# Altium project Hub.PrjPCB
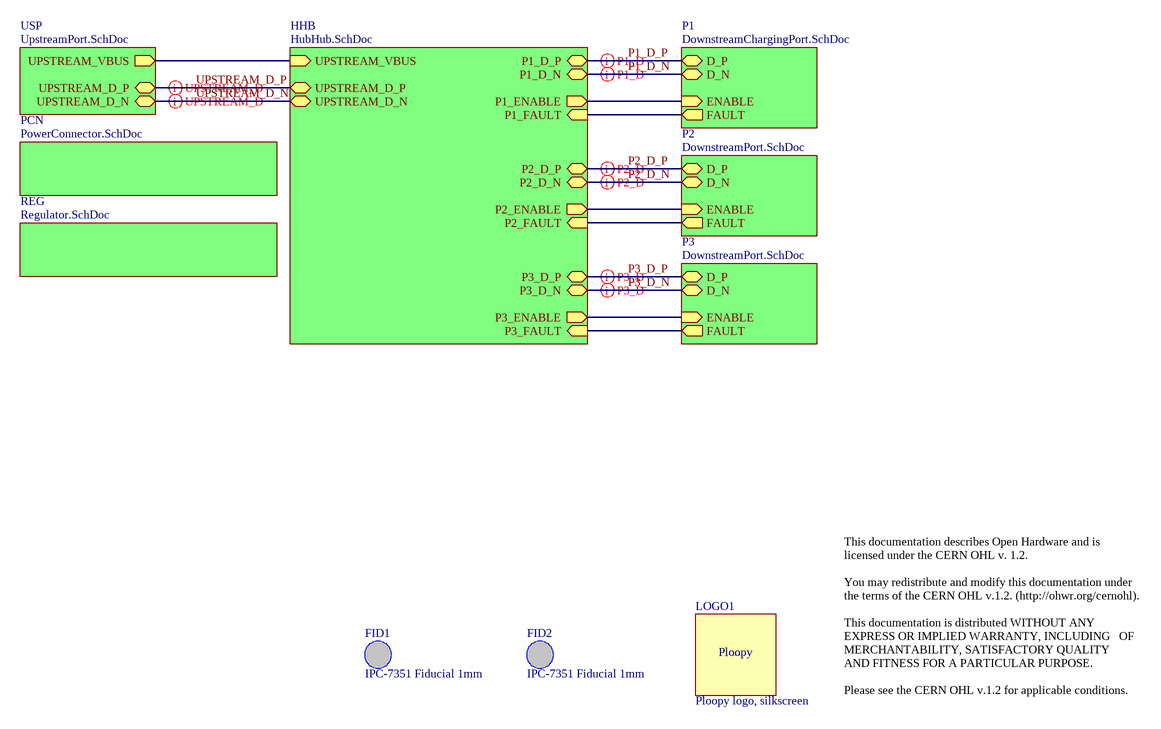
[diagram p0: Hub.SchDoc]
7 sheets, 80 parts. Net scope: hierarchical (ports join the sheet entries above them; power ports are global).
Board file: Hub.PcbDoc
Sheets:
  Hub.SchDoc
    P2 = DownstreamPort.SchDoc
    USP = UpstreamPort.SchDoc
    PCN = PowerConnector.SchDoc
    P1 = DownstreamChargingPort.SchDoc
    REG = Regulator.SchDoc
    HHB = HubHub.SchDoc
    P3 = DownstreamPort.SchDoc

## Sheet Hub.SchDoc
size Letter; CompanyName: Ploopy Co; Organization: Ploopy Co; Address1: 137-1140 Burnhamthorpe Road W; Address2: Mississauga; Address3: Ontario; Address4: Canada L5C 0A3; DocumentNumber: 1; Revision: R1.001; SheetNumber: 1; SheetTotal: 7

### Parts
FID1  IPC-7351 Fiducial 1mm  [FIDUCIAL_1.5]
FID2  IPC-7351 Fiducial 1mm  [FIDUCIAL_1.5]
LOGO1  Ploopy logo, silkscreen  [PloopyLogo]  (no BOM)

### Sub-sheets
HHB = HubHub.SchDoc: P1_ENABLE (out), P2_FAULT (in), P3_FAULT (in), P1_FAULT (in), UPSTREAM_VBUS (in), P3_ENABLE (out), P2_ENABLE (out), P3_D_P (bidir), UPSTREAM_D_P (bidir), P1_D_N (bidir), UPSTREAM_D_N (bidir), P2_D_P (bidir), P2_D_N (bidir), P1_D_P (bidir), P3_D_N (bidir)
P1 = DownstreamChargingPort.SchDoc: FAULT (out), ENABLE (in), D_N (bidir), D_P (bidir)
P2 = DownstreamPort.SchDoc: ENABLE (in), FAULT (out), D_N (bidir), D_P (bidir)
P3 = DownstreamPort.SchDoc: FAULT (out), ENABLE (in), D_N (bidir), D_P (bidir)
PCN = PowerConnector.SchDoc: no entries
REG = Regulator.SchDoc: no entries
USP = UpstreamPort.SchDoc: UPSTREAM_VBUS (out), UPSTREAM_D_N (bidir), UPSTREAM_D_P (bidir)

### Nets
P1_D_N: sheet P1/D_N, sheet HHB/P1_D_N
P1_D_P: sheet P1/D_P, sheet HHB/P1_D_P
P2_D_N: sheet P2/D_N, sheet HHB/P2_D_N
P2_D_P: sheet P2/D_P, sheet HHB/P2_D_P
P3_D_N: sheet HHB/P3_D_N, sheet P3/D_N
P3_D_P: sheet HHB/P3_D_P, sheet P3/D_P
UPSTREAM_D_N: sheet USP/UPSTREAM_D_N, sheet HHB/UPSTREAM_D_N
UPSTREAM_D_P: sheet USP/UPSTREAM_D_P, sheet HHB/UPSTREAM_D_P
NetR2_1: sheet USP/UPSTREAM_VBUS, sheet HHB/UPSTREAM_VBUS
NetR15_1: sheet P1/ENABLE, sheet HHB/P1_ENABLE
NetU1_3: sheet P1/FAULT, sheet HHB/P1_FAULT
NetU2_P2_3: sheet P2/FAULT, sheet HHB/P2_FAULT
NetU2_P2_4: sheet P2/ENABLE, sheet HHB/P2_ENABLE
NetU2_P3_3: sheet HHB/P3_FAULT, sheet P3/FAULT
NetU2_P3_4: sheet HHB/P3_ENABLE, sheet P3/ENABLE

Not connected (* = marked no-connect by the designer): FID1 1; FID2 1

### Layout directives
differential pair: P1_D_N, P1_D_P, P2_D_N, P2_D_P, P3_D_N, P3_D_P, UPSTREAM_D_N, UPSTREAM_D_P

### Notes on the sheet
- This documentation describes Open Hardware and is licensed under the CERN OHL v. 1.2.
  You may redistribute and modify this documentation under the terms of the CERN OHL v.1.2. (http://ohwr.org/cernohl).
  This documentation is distributed WITHOUT ANY EXPRESS OR IMPLIED WARRANTY, INCLUDING   OF MERCHANTABILITY, SATISFACTORY QUALITY   AND FITNESS FOR A PARTICULAR PURPOSE.
  Please see the CERN OHL v.1.2 for applicable conditions.
- Copyright Ploopy Corporation 2020
- Licensed under the CERN OHL v. 1.2
- http://ohwr.org/cernohl
- Title:
- PCB:
- Version:
- Ploopy Corporation
- Mississauga ON L5C 0A3
- 137-1140 Burnhamthorpe Road W
- Date:
- Time:
- Sheet
- of
- Canada
- (in symbol PloopyLogo) Ploopy

### Library data of the parts
FID1 FID2 = FIDUCIAL_1.5: PNP-Nzl: 2; PNP-dx: 0; PNP-X: 4; PNP-A: 1; PNP-Thk: 1.02; PNP-TS: 70; PNP-Type: MARK1; PNP-dy: 0; PNP-Y: 4; PNP-Pt: 0; PNP-W: 0; PNP-Lv: 1; PNP-Level: 1; PNP-Voff: 0; PNP-FeedType: Fiducial; PNP-TapeWidth: 0; PNP-PlacePriority: 0; PNP-TapeIndex: 0; PNP-da: 0
LOGO1 = PloopyLogo: PNP-Nzl: 2; PNP-dx: 0; PNP-X: 1; PNP-TS: 70; PNP-Type: CHI; PNP-FeedType: Tape; PNP-TapeWidth: 8; PNP-dy: 0; PNP-Y: 1; PNP-A: 0; PNP-Pt: 0; PNP-W: 0; PNP-Thk: 1; PNP-Lv: 1; PNP-Level: 1; PNP-Voff: 0; PNP-PlacePriority: 1; PNP-TapeIndex: 1; PNP-da: 0

## Sheet DownstreamPort.SchDoc
size Letter; CompanyName: Ploopy Co; Organization: Ploopy Co; Address1: 137-1140 Burnhamthorpe Road W; Address2: Mississauga; Address3: Ontario; Address4: Canada L5C 0A3; DocumentNumber: 5; Revision: R1.001; SheetNumber: 5; SheetTotal: 7
Used 2 times, as channels P2, P3. Parts and nets are listed once, with the designators drawn on the sheet.
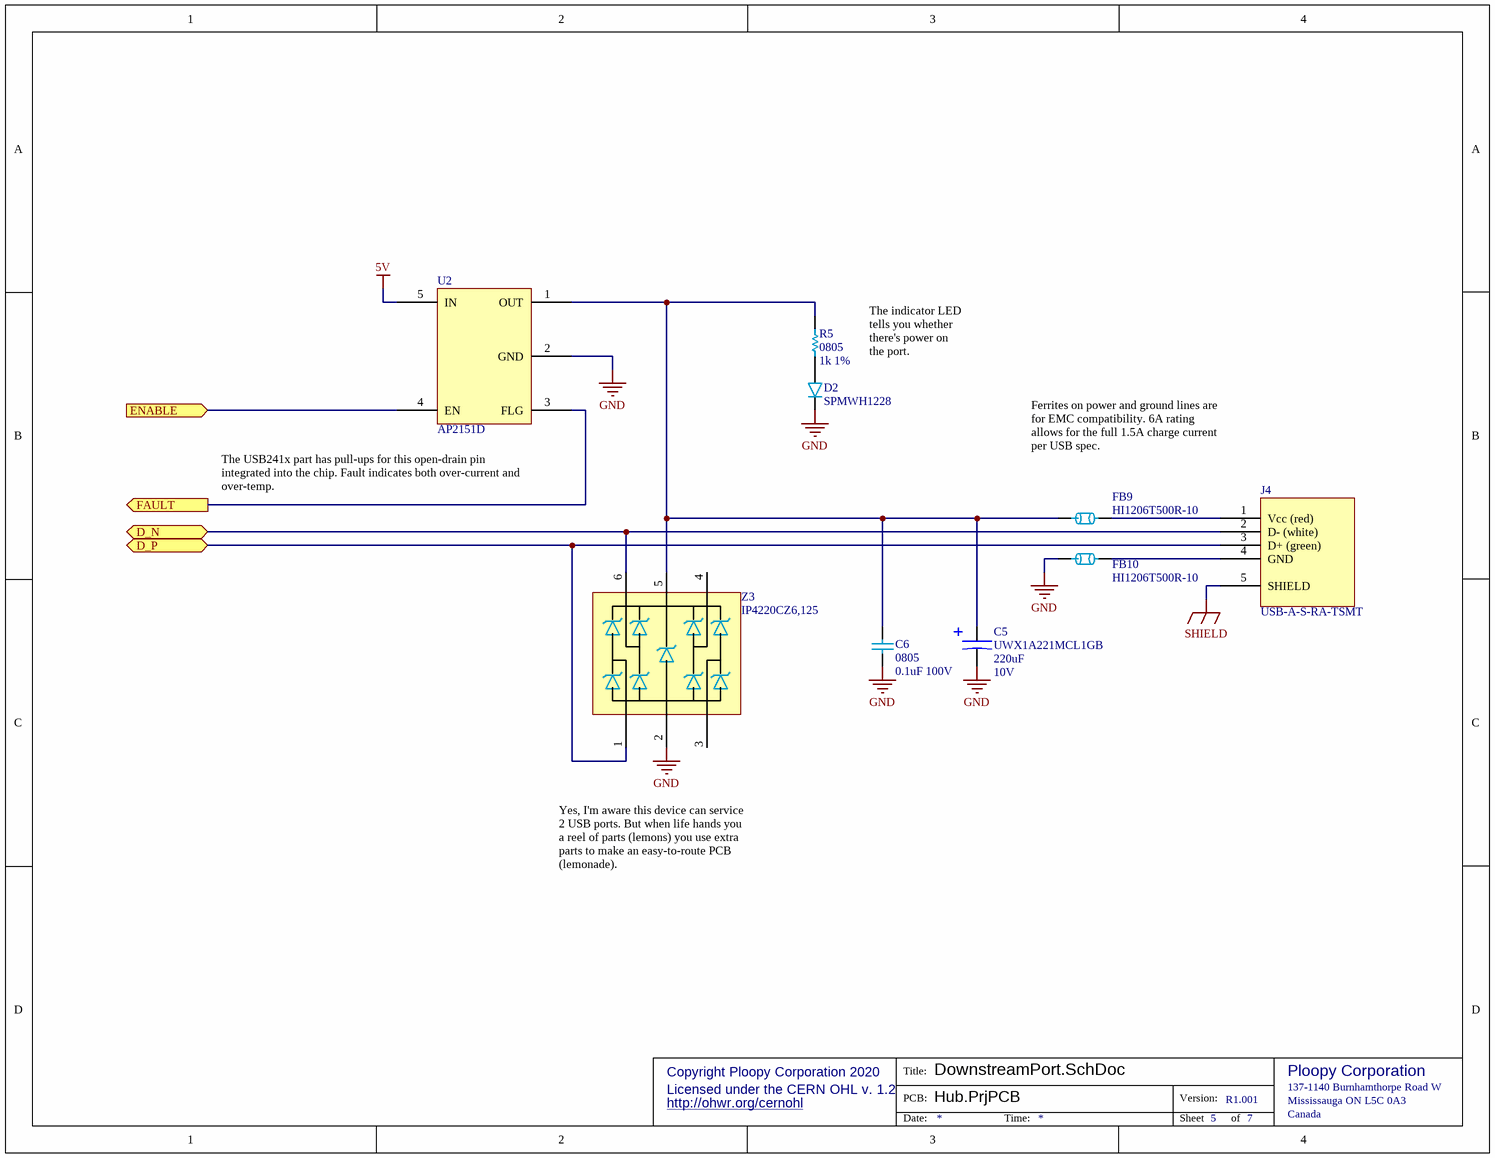
[diagram p1: DownstreamPort.SchDoc]

### Parts
C5  UWX1A221MCL1GB  value 220uF  Voltage: 10V  [Nichicon UWX - 8mm x 5.5mm]
C6  0805  value 0.1uF 100V  [0805]
D2  SPMWH1228  [SPMWH1228]
FB9  HI1206T500R-10  [1206]
FB10  HI1206T500R-10  [1206]
J4  USB-A-S-RA-TSMT  [USB-A-S-RA-TSMT]
R5  0805  value 1k 1%  [0805]
U2  AP2151D  [AP22811 - SOT95P285X140-5M]
Z3  IP4220CZ6,125  [PESD3V3S4UD - SOT95P275X110-6N]

### Ports
D_N (bidir), D_P (bidir), ENABLE (in), FAULT (out)

### Nets
5V: U2.5(IN)
GND: C5.2 C6.1 D2.2(C) FB10.1 U2.2(GND) Z3.2
SHIELD: J4.5(SHIELD)
D_N: J4.2(D-_(white)) Z3.6 ; port D_N
D_P: J4.3(D+_(green)) Z3.1 ; port D_P
ENABLE: U2.4(EN) ; port ENABLE
FAULT: U2.3(FLG) ; port FAULT
NetC5_1: C5.1 C6.2 FB9.1 R5.2 U2.1(OUT) Z3.5
NetD2_1: D2.1(A) R5.1
NetFB9_2: FB9.2 J4.1(Vcc_(red))
NetFB10_2: FB10.2 J4.4(GND)

Not connected (* = marked no-connect by the designer): Z3 3 4

### Channels
P2: designators end in _P2; ports D_N=P2_D_N D_P=P2_D_P ENABLE=NetU2_P2_4 FAULT=NetU2_P2_3
P3: designators end in _P3; ports D_N=P3_D_N D_P=P3_D_P ENABLE=NetU2_P3_4 FAULT=NetU2_P3_3

### Notes on the sheet
- The indicator LED tells you whether there's power on the port.
- (near U2) The USB241x part has pull-ups for this open-drain pin integrated into the chip. Fault indicates both over-current and over-temp.
- Ferrites on power and ground lines are for EMC compatibility. 6A rating allows for the full 1.5A charge current per USB spec.
- Yes, I'm aware this device can service 2 USB ports. But when life hands you a reel of parts (lemons) you use extra parts to make an easy-to-route PCB (lemonade).
- Copyright Ploopy Corporation 2020
- Licensed under the CERN OHL v. 1.2
- http://ohwr.org/cernohl
- Title:
- PCB:
- Version:
- Ploopy Corporation
- Mississauga ON L5C 0A3
- 137-1140 Burnhamthorpe Road W
- Date:
- Time:
- Sheet
- of
- Canada

### Library data of the parts
C5 = UWX1A221MCL1GB: 220uF 10V Electrolytic Capacitor, SMD; PNP-Nzl: 6; PNP-dx: 0; PNP-X: 8.3; PNP-Y: 1; PNP-Pt: 2; PNP-Thk: 5.4; PNP-Lv: 26; PNP-TS: 70; PNP-Type: CAP; PNP-FeedType: Tape; PNP-TapeWidth: 16; PNP-TapeIndex: 3; PNP-dy: 0; PNP-A: 0; PNP-W: 0; PNP-Level: 1; PNP-Voff: 0; PNP-PlacePriority: 2; PNP-da: 0; Supplier 1: Digi-Key; Supplier Part Number 1: 493-2098-1-ND
C6 = Cap 0.1uF 100V: 0805, X5R or better; Supplier 1: Digi-Key; Supplier Part Number 1: 1276-6840-2-ND
D2 = SPMWH1228: 3V/0.5W white LED, 2.8mm x 3.5mm; Supplier 2: Digi-Key; Supplier Part Number 2: 1510-1428-1-ND; Supplier 3: Digi-Key; Supplier Part Number 3: 1510-1429-1-ND; Supplier 1: Arrow
FB9 FB10 = HI1206T500R-10: 50 Ohms @ 100MHz 1 Power, Signal Line Ferrite Bead 1206 (3216 Metric) 6A 10mOhm; Value: Ferrite Bead 50R 6A; Supplier 1: Digi-Key; Supplier 2: Mouser; Supplier Part Number 1: 240-2412-1-ND; Supplier Part Number 2: 875-HI1206T500R-10
J4 = USB-A-S-RA-TSMT: USB - A USB 2.0 Receptacle Connector 4 Position Surface Mount, Right Angle; Supplier 1: Digi-Key; Supplier 2: Future Electronics; Supplier 3: Mouser; Supplier Part Number 1: 2057-USB-A-S-RA-TSMT-ND; Supplier Part Number 2: USB-A-S-RA-TSMT-TRAY; Supplier Part Number 3: 490-UJ2-AH-1-SMT-TR
R5 = Res 1k 1% 0805: Chip resistor, 1/8W 100PPM; Supplier 1: Digi-Key; Supplier Part Number 1: RMCF0805FT1K00TR-ND
U2 = AP2151D: USB Power Switch/Driver 500mA SOT-25; Supplier 1: Digi-Key; Supplier 2: Mouser; Supplier Part Number 1: AP2151DWG-7DICT-ND; Supplier Part Number 2: 621-AP2151DWG-7
Z3 = IP4220CZ6,125: TVS DIODE 5.5V 6TSOP (Low capacitance, USB); Supplier 1: Digi-Key; Supplier 2: Mouser; Supplier 3: Arrow; Supplier Part Number 1: 1727-3578-1-ND; Supplier Part Number 2: 771-IP4220CZ6-T/R; Supplier Part Number 3: IP4220CZ6,125

## Sheet UpstreamPort.SchDoc
size Letter; CompanyName: Ploopy Co; Organization: Ploopy Co; Address1: 137-1140 Burnhamthorpe Road W; Address2: Mississauga; Address3: Ontario; Address4: Canada L5C 0A3; DocumentNumber: 3; Revision: R1.001; SheetNumber: 3; SheetTotal: 7
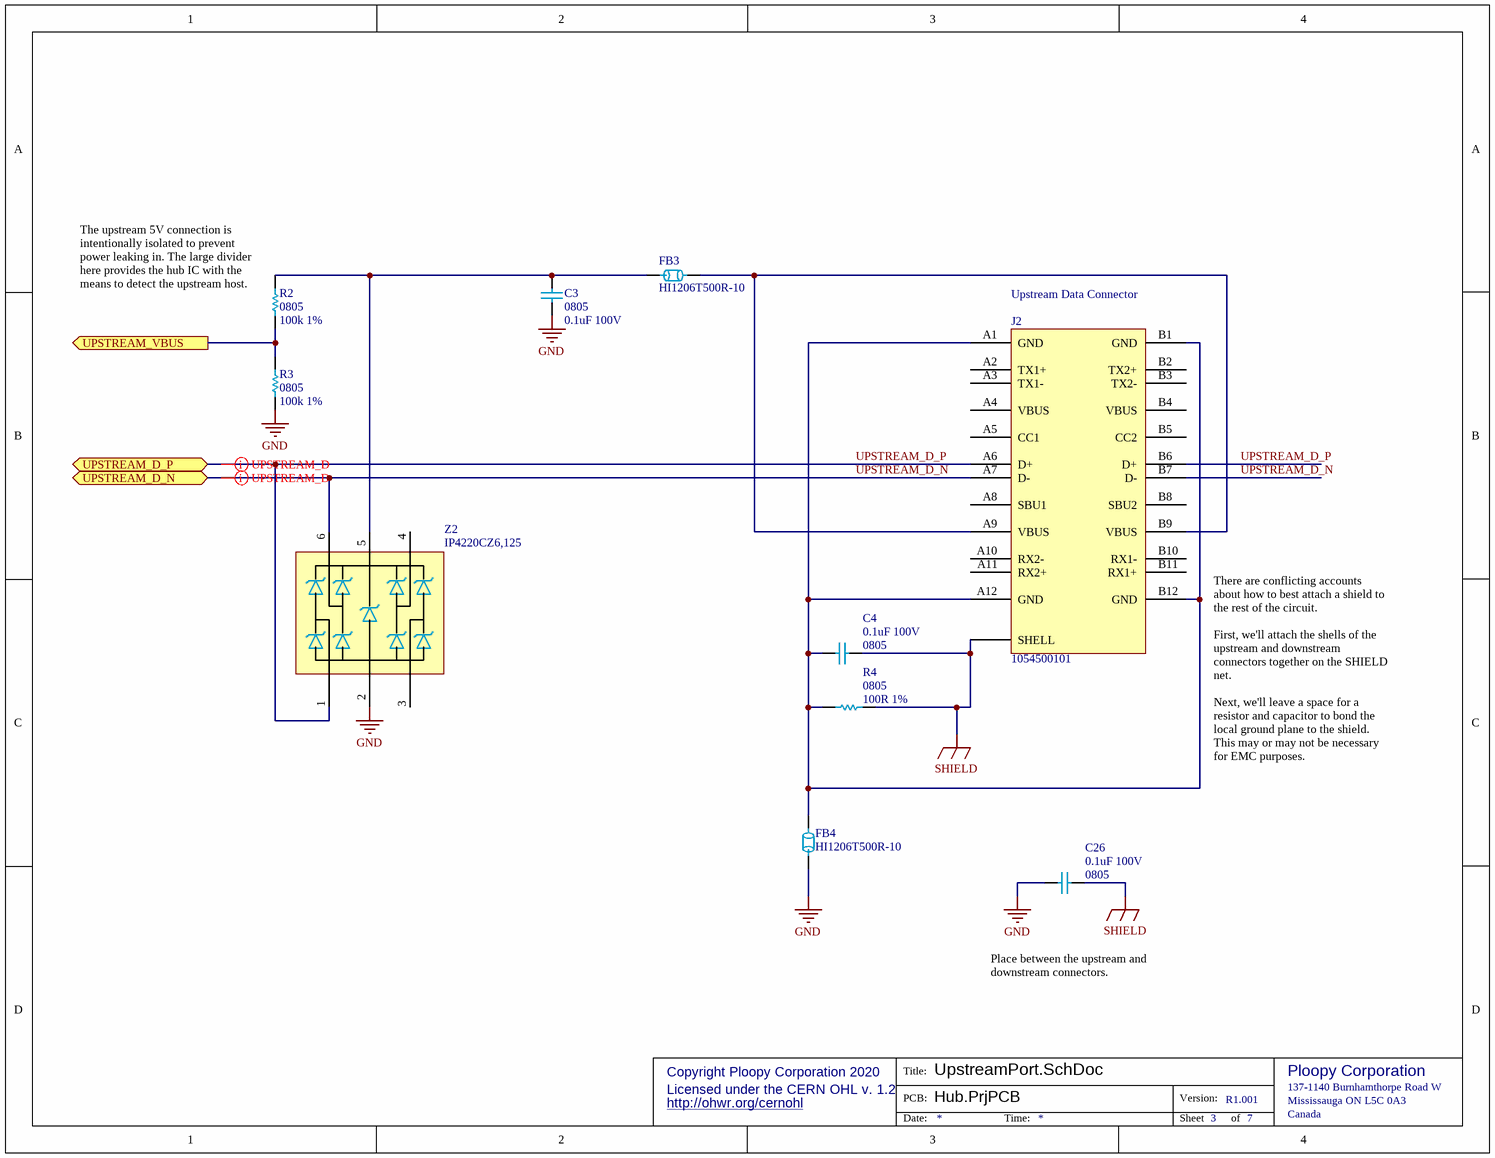
[diagram p2: UpstreamPort.SchDoc]

### Parts
C3  0805  value 0.1uF 100V  [0805]
C4  0805  value 0.1uF 100V  [0805]
C26  0805  value 0.1uF 100V  [0805]
FB3  HI1206T500R-10  [1206]
FB4  HI1206T500R-10  [1206]
J2  1054500101  [1054500101]
R2  0805  value 100k 1%  [0805]
R3  0805  value 100k 1%  [0805]
R4  0805  value 100R 1%  [0805]
Z2  IP4220CZ6,125  [PESD3V3S4UD - SOT95P275X110-6N]

### Ports
UPSTREAM_D_N (bidir), UPSTREAM_D_P (bidir), UPSTREAM_VBUS (out)

### Nets
GND: C3.1 C26.1 FB4.1 R3.1 Z2.2
SHIELD: C4.2 C26.2 J2.SHELL R4.2
UPSTREAM_D_N: J2.A7(D-) J2.B7(D-) Z2.6 ; port UPSTREAM_D_N
UPSTREAM_D_P: J2.A6(D+) J2.B6(D+) Z2.1 ; port UPSTREAM_D_P
NetC3_2: C3.2 FB3.1 R2.2 Z2.5
NetC4_1: C4.1 FB4.2 J2.A1(GND) J2.A12(GND) J2.B1(GND) J2.B12(GND) R4.1
NetFB3_2: FB3.2 J2.A9(VBUS) J2.B9(VBUS)
NetR2_1: R2.1 R3.2 ; port UPSTREAM_VBUS

Not connected (* = marked no-connect by the designer): J2 A2(TX1+) A3(TX1-) A4(VBUS) A5(CC1) A8(SBU1) A10(RX2-) A11(RX2+) B2(TX2+) B3(TX2-) B4(VBUS) B5(CC2) B8(SBU2) B10(RX1-) B11(RX1+); Z2 3 4

### Layout directives
differential pair: UPSTREAM_D_N, UPSTREAM_D_P

### Notes on the sheet
- (near J2) Upstream Data Connector
- (near R2) The upstream 5V connection is intentionally isolated to prevent power leaking in. The large divider here provides the hub IC with the means to detect the upstream host.
- There are conflicting accounts about how to best attach a shield to the rest of the circuit.
  First, we'll attach the shells of the upstream and downstream connectors together on the SHIELD net.
  Next, we'll leave a space for a resistor and capacitor to bond the local ground plane to the shield. This may or may not be necessary for EMC purposes.
- Place between the upstream and downstream connectors.
- Copyright Ploopy Corporation 2020
- Licensed under the CERN OHL v. 1.2
- http://ohwr.org/cernohl
- Title:
- PCB:
- Version:
- Ploopy Corporation
- Mississauga ON L5C 0A3
- 137-1140 Burnhamthorpe Road W
- Date:
- Time:
- Sheet
- of
- Canada

### Library data of the parts
C3 C4 C26 = Cap 0.1uF 100V: 0805, X5R or better; Supplier 1: Digi-Key; Supplier Part Number 1: 1276-6840-2-ND
FB3 FB4 = HI1206T500R-10: as FB9 on sheet DownstreamPort; Supplier 1: Digi-Key; Supplier 2: Mouser; Supplier Part Number 1: 240-2412-1-ND; Supplier Part Number 2: 875-HI1206T500R-10
J2 = 1054500101: USB - C (Type - C) USB 3.1 (USB 3.1 Gen 2, Superspeed+) Receptacle Connector 24 Position Surface Mount, Right Angle; Through Hole; Supplier 1: Digi-Key; Supplier 2: Arrow; Supplier Part Number 2: 105450-0101; Supplier Part Number 1: WM12856CT-ND
R2 R3 = Res 100k 1% 0805: Chip resistor; Supplier 1: Digi-Key; Supplier 2: Digi-Key; Supplier Part Number 1: RMCF0805FT100KTR-ND; Supplier Part Number 2: RMCF0805FT100KCT-ND
R4 = Res 100R 1% 0805: Chip resistor; Supplier 1: Digi-Key; Supplier 2: Digi-Key; Supplier Part Number 1: RMCF0805FT100RCT-ND; Supplier Part Number 2: RMCF0805FT100RTR-ND
Z2 = IP4220CZ6,125: as Z3 on sheet DownstreamPort; Supplier 1: Digi-Key; Supplier 2: Mouser; Supplier 3: Arrow; Supplier Part Number 1: 1727-3578-1-ND; Supplier Part Number 2: 771-IP4220CZ6-T/R; Supplier Part Number 3: IP4220CZ6,125

## Sheet PowerConnector.SchDoc
size Letter; CompanyName: Ploopy Co; Organization: Ploopy Co; Address1: 137-1140 Burnhamthorpe Road W; Address2: Mississauga; Address3: Ontario; Address4: Canada L5C 0A3; DocumentNumber: 4; Revision: R1.001; SheetNumber: 4; SheetTotal: 7
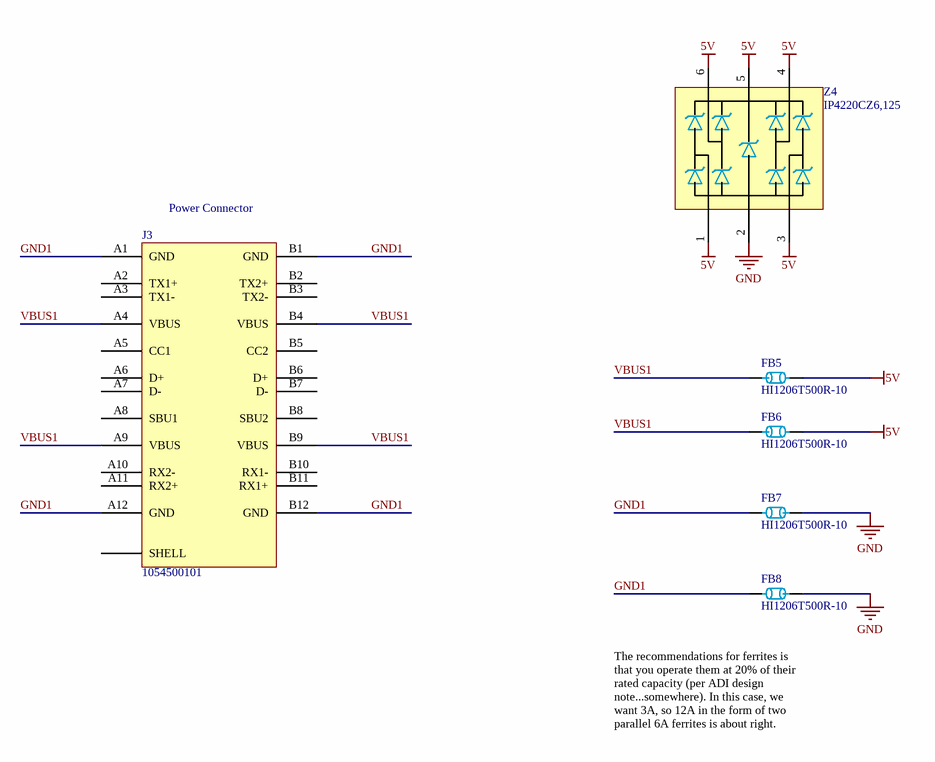
[diagram p3: PowerConnector.SchDoc]

### Parts
FB5  HI1206T500R-10  [1206]
FB6  HI1206T500R-10  [1206]
FB7  HI1206T500R-10  [1206]
FB8  HI1206T500R-10  [1206]
J3  1054500101  [1054500101]
Z4  IP4220CZ6,125  [PESD3V3S4UD - SOT95P275X110-6N]

### Nets
5V: FB5.2 FB6.2 Z4.1 Z4.3 Z4.4 Z4.5 Z4.6
GND: FB7.1 FB8.1 Z4.2
GND1: FB7.2 FB8.2 J3.A1(GND) J3.A12(GND) J3.B1(GND) J3.B12(GND)
VBUS1: FB5.1 FB6.1 J3.A4(VBUS) J3.A9(VBUS) J3.B4(VBUS) J3.B9(VBUS)

Not connected (* = marked no-connect by the designer): J3 A2(TX1+) A3(TX1-) A5(CC1) A6(D+) A7(D-) A8(SBU1) A10(RX2-) A11(RX2+) B2(TX2+) B3(TX2-) B5(CC2) B6(D+) B7(D-) B8(SBU2) B10(RX1-) B11(RX1+) SHELL

### Notes on the sheet
- (near J3) Power Connector
- The recommendations for ferrites is that you operate them at 20% of their rated capacity (per ADI design note...somewhere). In this case, we want 3A, so 12A in the form of two parallel 6A ferrites is about right.
- Copyright Ploopy Corporation 2020
- Licensed under the CERN OHL v. 1.2
- http://ohwr.org/cernohl
- Title:
- PCB:
- Version:
- Ploopy Corporation
- Mississauga ON L5C 0A3
- 137-1140 Burnhamthorpe Road W
- Date:
- Time:
- Sheet
- of
- Canada

### Library data of the parts
FB5-FB8 = HI1206T500R-10: as FB9 on sheet DownstreamPort; Supplier 1: Digi-Key; Supplier 2: Mouser; Supplier Part Number 1: 240-2412-1-ND; Supplier Part Number 2: 875-HI1206T500R-10
J3 = 1054500101: as J2 on sheet UpstreamPort; Supplier 1: Digi-Key; Supplier 2: Arrow; Supplier Part Number 2: 105450-0101; Supplier Part Number 1: WM12856CT-ND
Z4 = IP4220CZ6,125: as Z3 on sheet DownstreamPort; Supplier 1: Digi-Key; Supplier 2: Mouser; Supplier 3: Arrow; Supplier Part Number 1: 1727-3578-1-ND; Supplier Part Number 2: 771-IP4220CZ6-T/R; Supplier Part Number 3: IP4220CZ6,125

## Sheet DownstreamChargingPort.SchDoc
size Letter; CompanyName: Ploopy Co; Organization: Ploopy Co; Address1: 137-1140 Burnhamthorpe Road W; Address2: Mississauga; Address3: Ontario; Address4: Canada L5C 0A3; DocumentNumber: 2; Revision: R1.001; SheetNumber: 2; SheetTotal: 7
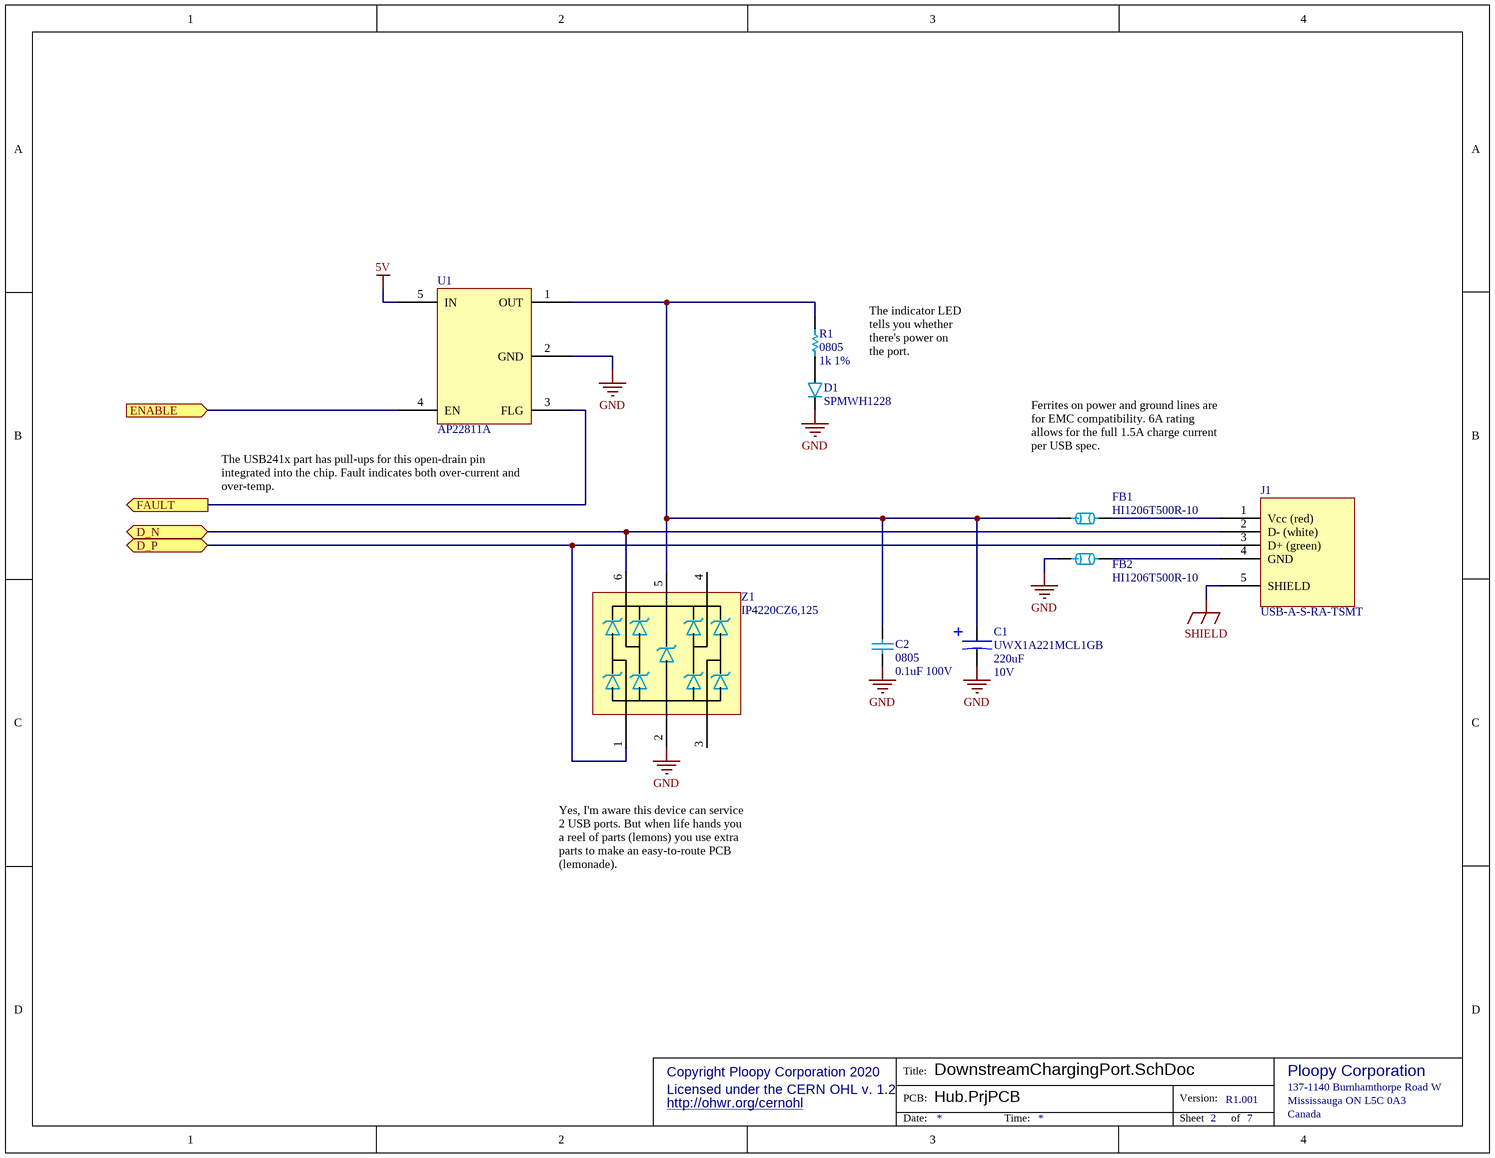
[diagram p4: DownstreamChargingPort.SchDoc]

### Parts
C1  UWX1A221MCL1GB  value 220uF  Voltage: 10V  [Nichicon UWX - 8mm x 5.5mm]
C2  0805  value 0.1uF 100V  [0805]
D1  SPMWH1228  [SPMWH1228]
FB1  HI1206T500R-10  [1206]
FB2  HI1206T500R-10  [1206]
J1  USB-A-S-RA-TSMT  [USB-A-S-RA-TSMT]
R1  0805  value 1k 1%  [0805]
U1  AP22811A  [AP22811 - SOT95P285X140-5M]
Z1  IP4220CZ6,125  [PESD3V3S4UD - SOT95P275X110-6N]

### Ports
D_N (bidir), D_P (bidir), ENABLE (in), FAULT (out)

### Nets
5V: U1.5(IN)
GND: C1.2 C2.1 D1.2(C) FB2.1 U1.2(GND) Z1.2
SHIELD: J1.5(SHIELD)
P1_D_N: J1.2(D-_(white)) Z1.6 ; port D_N
P1_D_P: J1.3(D+_(green)) Z1.1 ; port D_P
NetC1_1: C1.1 C2.2 FB1.1 R1.2 U1.1(OUT) Z1.5
NetD1_1: D1.1(A) R1.1
NetFB1_2: FB1.2 J1.1(Vcc_(red))
NetFB2_2: FB2.2 J1.4(GND)
NetR15_1: U1.4(EN) ; port ENABLE
NetU1_3: U1.3(FLG) ; port FAULT

Not connected (* = marked no-connect by the designer): Z1 3 4

### Notes on the sheet
- The indicator LED tells you whether there's power on the port.
- (near U1) The USB241x part has pull-ups for this open-drain pin integrated into the chip. Fault indicates both over-current and over-temp.
- Ferrites on power and ground lines are for EMC compatibility. 6A rating allows for the full 1.5A charge current per USB spec.
- Yes, I'm aware this device can service 2 USB ports. But when life hands you a reel of parts (lemons) you use extra parts to make an easy-to-route PCB (lemonade).
- Copyright Ploopy Corporation 2020
- Licensed under the CERN OHL v. 1.2
- http://ohwr.org/cernohl
- Title:
- PCB:
- Version:
- Ploopy Corporation
- Mississauga ON L5C 0A3
- 137-1140 Burnhamthorpe Road W
- Date:
- Time:
- Sheet
- of
- Canada

### Library data of the parts
C1 = UWX1A221MCL1GB: as C5 on sheet DownstreamPort; PNP-dy: 0; PNP-A: 0; PNP-W: 0; PNP-Level: 1; PNP-Voff: 0; PNP-PlacePriority: 2; PNP-da: 0; Supplier 1: Digi-Key; Supplier Part Number 1: 493-2098-1-ND
C2 = Cap 0.1uF 100V: 0805, X5R or better; Supplier 1: Digi-Key; Supplier Part Number 1: 1276-6840-2-ND
D1 = SPMWH1228: 3V/0.5W white LED, 2.8mm x 3.5mm; Supplier 2: Digi-Key; Supplier Part Number 2: 1510-1428-1-ND; Supplier 3: Digi-Key; Supplier Part Number 3: 1510-1429-1-ND; Supplier 1: Arrow
FB1 FB2 = HI1206T500R-10: as FB9 on sheet DownstreamPort; Supplier 1: Digi-Key; Supplier 2: Mouser; Supplier Part Number 1: 240-2412-1-ND; Supplier Part Number 2: 875-HI1206T500R-10
J1 = USB-A-S-RA-TSMT: as J4 on sheet DownstreamPort; Supplier 1: Digi-Key; Supplier 2: Future Electronics; Supplier 3: Mouser; Supplier Part Number 1: 2057-USB-A-S-RA-TSMT-ND; Supplier Part Number 2: USB-A-S-RA-TSMT-TRAY; Supplier Part Number 3: 490-UJ2-AH-1-SMT-TR
R1 = Res 1k 1% 0805: Chip resistor, 1/8W 100PPM; Supplier 1: Digi-Key; Supplier Part Number 1: RMCF0805FT1K00TR-ND
U1 = AP22811A: USB Power Switch/Driver 1:1 P-Channel 2A SOT-25; Supplier 1: Digi-Key; Supplier 2: Mouser; Supplier Part Number 1: AP22811AW5-7DICT-ND; Supplier Part Number 2: 621-AP22811AW5-7
Z1 = IP4220CZ6,125: as Z3 on sheet DownstreamPort; Supplier 1: Digi-Key; Supplier 2: Mouser; Supplier 3: Arrow; Supplier Part Number 1: 1727-3578-1-ND; Supplier Part Number 2: 771-IP4220CZ6-T/R; Supplier Part Number 3: IP4220CZ6,125

## Sheet Regulator.SchDoc
size Letter; CompanyName: Ploopy Co; Organization: Ploopy Co; Address1: 137-1140 Burnhamthorpe Road W; Address2: Mississauga; Address3: Ontario; Address4: Canada L5C 0A3; DocumentNumber: 6; Revision: R1.001; SheetNumber: 6; SheetTotal: 7
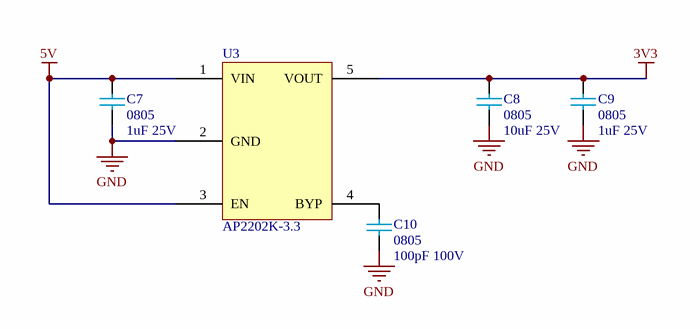
[diagram p5: Regulator.SchDoc]

### Parts
C7  0805  value 1uF 25V  [0805]
C8  0805  value 10uF 25V  [0805]
C9  0805  value 1uF 25V  [0805]
C10  0805  value 100pF 100V  [0805]
U3  AP2202K-3.3  [AP2202 - SOT95P270X145-5N]

### Nets
3V3: C8.2 C9.2 U3.5(VOUT)
5V: C7.2 U3.1(VIN) U3.3(EN)
GND: C7.1 C8.1 C9.1 C10.1 U3.2(GND)
NetC10_2: C10.2 U3.4(BYP)

### Notes on the sheet
- Copyright Ploopy Corporation 2020
- Licensed under the CERN OHL v. 1.2
- http://ohwr.org/cernohl
- Title:
- PCB:
- Version:
- Ploopy Corporation
- Mississauga ON L5C 0A3
- 137-1140 Burnhamthorpe Road W
- Date:
- Time:
- Sheet
- of
- Canada

### Library data of the parts
C7 C9 = Cap 1uF 25V: 0805, X5R or better; PNP-Nzl: 2; PNP-dx: 0; PNP-Level: 1; PNP-Thk: 1.25; PNP-TS: 70; PNP-Type: chi; PNP-X: 2.00; PNP-FeedType: Tape; PNP-TapeWidth: 8; Supplier 1: Digi-Key; Supplier Part Number 1: 1276-1066-2-ND; Supplier 2: Digi-Key; Supplier Part Number 2: 1276-1066-1-ND; PNP-dy: 0; PNP-Lv: 1; PNP-Pt: 0; PNP-Voff: 0; PNP-W: 0; PNP-Y: 1.25; PNP-A: 0; PNP-PlacePriority: 1; PNP-TapeIndex: 1; PNP-da: 0
C8 = Cap 10uF 25V: 0805, X5R or better; PNP-Nzl: 2; PNP-dx: 0; PNP-X: 2.00; PNP-Y: 1.25; PNP-Lv: 1; PNP-TS: 70; PNP-Type: chi; PNP-FeedType: Tape; PNP-TapeWidth: 8; PNP-dy: 0; PNP-Pt: 0; PNP-W: 0; PNP-Thk: 1.25; PNP-Level: 1; PNP-Voff: 0; PNP-PlacePriority: 1; PNP-A: 0; PNP-TapeIndex: 1; Supplier 1: Mouser; Supplier Part Number 1: 81-GRM21BR61E106KA3L; Supplier 2: Digi-Key; Supplier Part Number 2: 490-5523-1-ND; PNP-da: 0
C10 = Cap 100pF 100V: 0805, X5R or better; PNP-Nzl: 2; PNP-dx: 0; PNP-X: 2.00; PNP-Y: 1.25; PNP-Thk: 0.60; PNP-Lv: 1; PNP-TS: 70; PNP-Type: chi; PNP-FeedType: Tape; PNP-TapeWidth: 8; Supplier 1: Digi-Key; Supplier Part Number 1: 1276-2426-1-ND; Supplier 2: Digi-Key; Supplier Part Number 2: 1276-2426-2-ND; PNP-dy: 0; PNP-Pt: 0; PNP-W: 0; PNP-Level: 1; PNP-Voff: 0; PNP-PlacePriority: 1; PNP-A: 0; PNP-TapeIndex: 1; Supplier 3: Arrow; Supplier Part Number 3: L5XIfgkrxsBQF2sGZ85JNyFE59-nywaq7sHwLppiklbTEIlO4Ffw3x4_A6bjf4Mm; PNP-da: 0
U3 = AP2202K-3.3: 3.3V 150mA LDO regulator; PNP-Nzl: 2; PNP-dx: 0; PNP-X: 2.9; PNP-Y: 1.3; PNP-A: 90; PNP-Thk: 1; PNP-Lv: 26; PNP-Type: CHP; PNP-FeedType: Tape; PNP-TapeWidth: 8; PNP-PlacePriority: 3; PNP-dy: 0; PNP-Pt: 0; PNP-W: 0; PNP-TS: 90; PNP-Level: 1; PNP-Voff: 0; PNP-TapeIndex: 1; Supplier 1: Mouser; Supplier Part Number 1: 621-AP2202K-3.3TRG1; Supplier 2: Digi-Key; Supplier Part Number 2: AP2202K-3.3TRG1DICT-ND; Supplier 3: Arrow; Supplier Part Number 3: PWagzdsTFFHKE_U17B45SP-NtndBrheJIaI5hB7gHD0ZVywxIBNyoAQstvnyfZZ0; PNP-da: 0

## Sheet HubHub.SchDoc
size Legal; CompanyName: Ploopy Co; Organization: Ploopy Co; Address1: 137-1140 Burnhamthorpe Road W; Address2: Mississauga; Address3: Ontario; Address4: Canada L5C 0A3; DocumentNumber: 7; Revision: R1.001; SheetNumber: 7; SheetTotal: 7
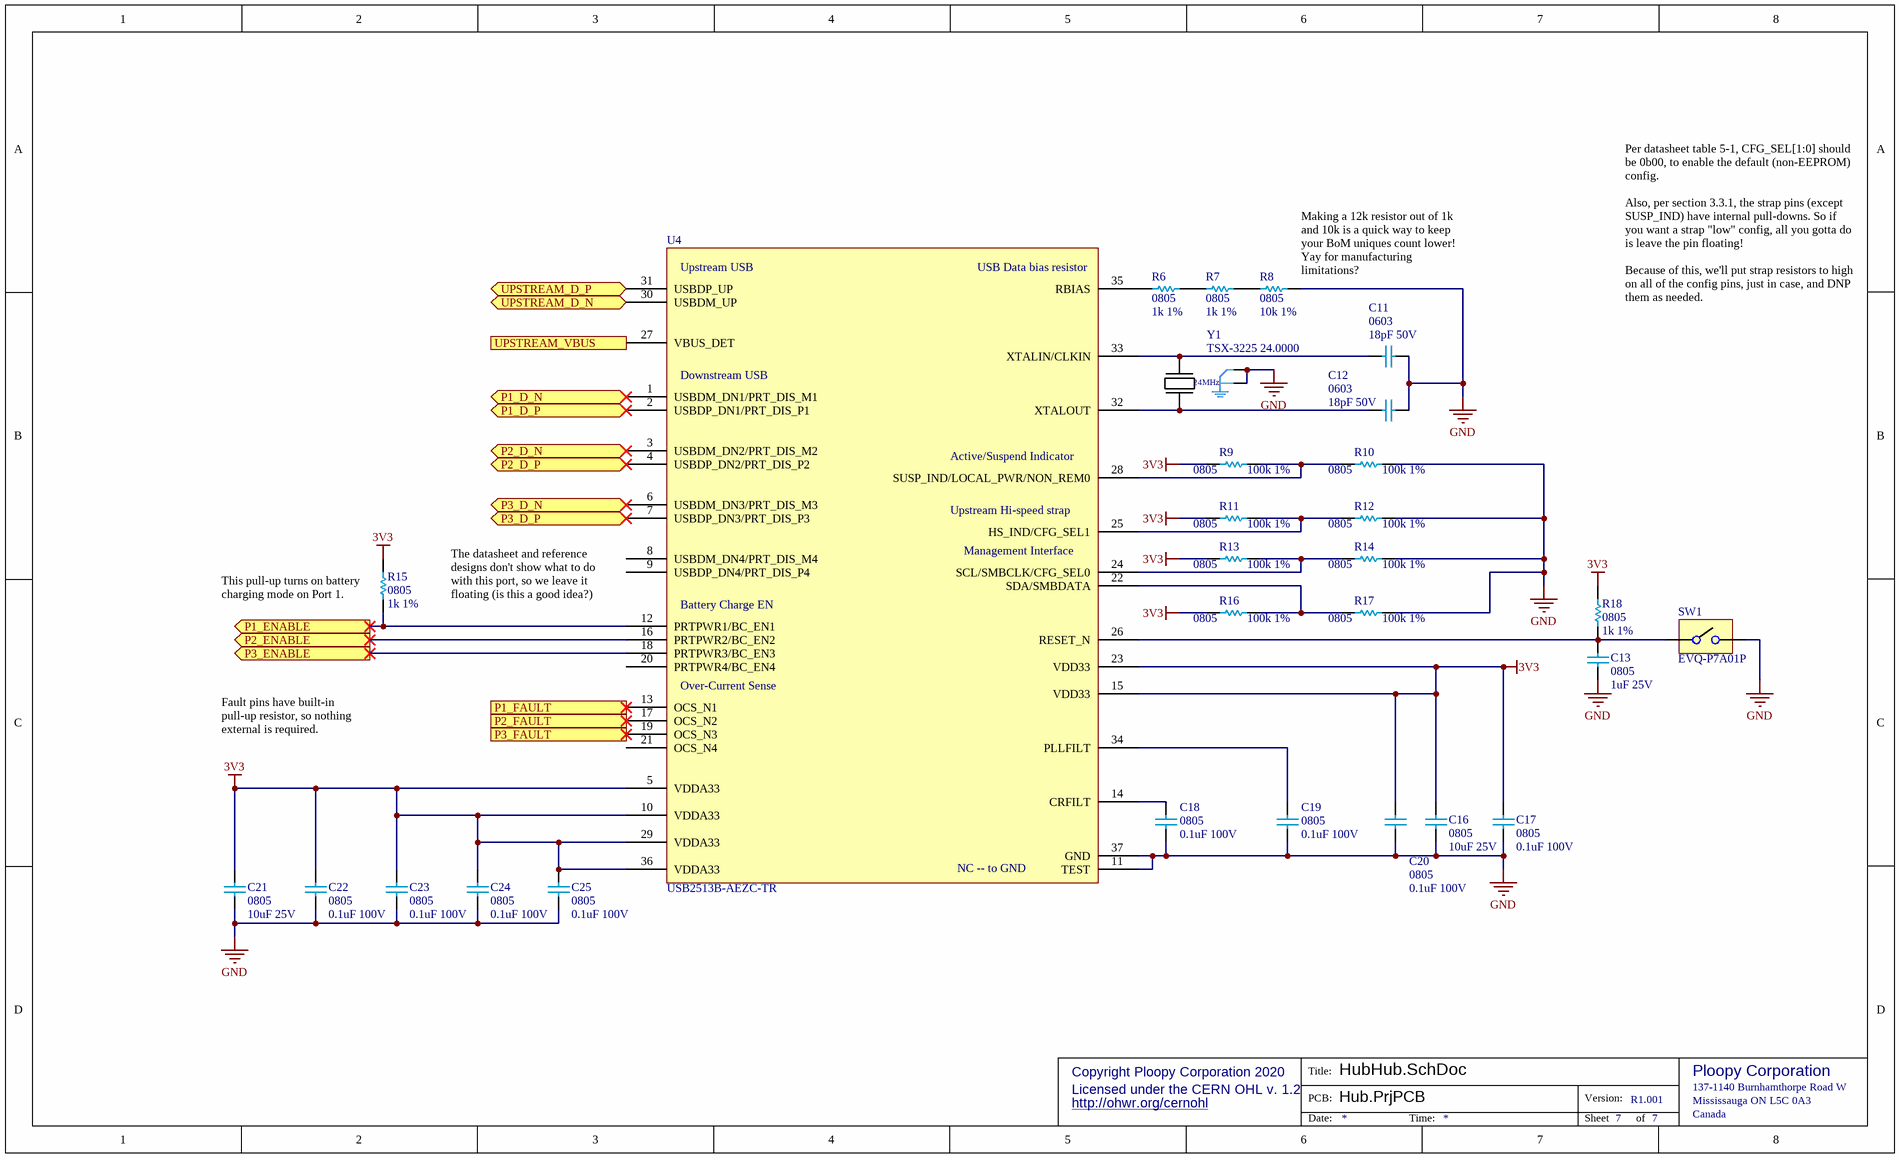
[diagram p6: HubHub.SchDoc]

### Parts
C11  0603  value 18pF 50V  [0603]
C12  0603  value 18pF 50V  [0603]
C13  0805  value 1uF 25V  [0805]
C16  0805  value 10uF 25V  [0805]
C17  0805  value 0.1uF 100V  [0805]
C18  0805  value 0.1uF 100V  [0805]
C19  0805  value 0.1uF 100V  [0805]
C20  0805  value 0.1uF 100V  [0805]
C21  0805  value 10uF 25V  [0805]
C22  0805  value 0.1uF 100V  [0805]
C23  0805  value 0.1uF 100V  [0805]
C24  0805  value 0.1uF 100V  [0805]
C25  0805  value 0.1uF 100V  [0805]
R6  0805  value 1k 1%  [0805]
R7  0805  value 1k 1%  [0805]
R8  0805  value 10k 1%  [0805]
R9  0805  value 100k 1%  [0805]
R10  0805  value 100k 1%  [0805]
R11  0805  value 100k 1%  [0805]
R12  0805  value 100k 1%  [0805]
R13  0805  value 100k 1%  [0805]
R14  0805  value 100k 1%  [0805]
R15  0805  value 1k 1%  [0805]
R16  0805  value 100k 1%  [0805]
R17  0805  value 100k 1%  [0805]
R18  0805  value 1k 1%  [0805]
SW1  EVQ-P7A01P  [EVQ-PQHB55]
U4  USB2513B-AEZC-TR  [USB2513B - QFN50P600X600X100_HS-37M]
Y1  TSX-3225 24.0000  [TSX-3225]

### Ports
P1_D_N (bidir), P1_D_P (bidir), P1_ENABLE (out), P1_FAULT (in), P2_D_N (bidir), P2_D_P (bidir), P2_ENABLE (out), P2_FAULT (in), P3_D_N (bidir), P3_D_P (bidir), P3_ENABLE (out), P3_FAULT (in), UPSTREAM_D_N (bidir), UPSTREAM_D_P (bidir), UPSTREAM_VBUS (in)

### Nets
3V3: C16.2 C17.2 C20.2 C21.2 C22.2 C23.2 C24.2 C25.2 R9.1 R11.1 R13.1 R15.2 R16.1 R18.2 U4.5(VDDA33) U4.10(VDDA33) U4.15(VDD33) U4.23(VDD33) U4.29(VDDA33) U4.36(VDDA33)
GND: C11.1 C12.1 C13.1 C16.1 C17.1 C18.1 C19.1 C20.1 C21.1 C22.1 C23.1 C24.1 C25.1 R8.1 R10.1 R12.1 R14.1 R17.1 SW1.B U4.11(TEST) U4.37(GND) Y1.2 Y1.4
P1_D_N: U4.1(USBDM_DN1/PRT_DIS_M1) ; port P1_D_N
P1_D_P: U4.2(USBDP_DN1/PRT_DIS_P1) ; port P1_D_P
P2_D_N: U4.3(USBDM_DN2/PRT_DIS_M2) ; port P2_D_N
P2_D_P: U4.4(USBDP_DN2/PRT_DIS_P2) ; port P2_D_P
P3_D_N: U4.6(USBDM_DN3/PRT_DIS_M3) ; port P3_D_N
P3_D_P: U4.7(USBDP_DN3/PRT_DIS_P3) ; port P3_D_P
UPSTREAM_D_N: U4.30(USBDM_UP) ; port UPSTREAM_D_N
UPSTREAM_D_P: U4.31(USBDP_UP) ; port UPSTREAM_D_P
NetC11_2: C11.2 U4.33(XTALIN/CLKIN) Y1.1
NetC12_2: C12.2 U4.32(XTALOUT) Y1.3
NetC13_2: C13.2 R18.1 SW1.A U4.26(RESET_N)
NetC18_2: C18.2 U4.14(CRFILT)
NetC19_2: C19.2 U4.34(PLLFILT)
NetR2_1: U4.27(VBUS_DET) ; port UPSTREAM_VBUS
NetR6_1: R6.1 R7.2
NetR6_2: R6.2 U4.35(RBIAS)
NetR7_1: R7.1 R8.2
NetR9_2: R9.2 R10.2 U4.28(SUSP_IND/LOCAL_PWR/NON_REM0)
NetR11_2: R11.2 R12.2 U4.25(HS_IND/CFG_SEL1)
NetR13_2: R13.2 R14.2 U4.24(SCL/SMBCLK/CFG_SEL0)
NetR15_1: R15.1 U4.12(PRTPWR1/BC_EN1) ; port P1_ENABLE
NetR16_2: R16.2 R17.2 U4.22(SDA/SMBDATA)
NetU1_3: U4.13(OCS_N1) ; port P1_FAULT
NetU2_P2_3: U4.17(OCS_N2) ; port P2_FAULT
NetU2_P2_4: U4.16(PRTPWR2/BC_EN2) ; port P2_ENABLE
NetU2_P3_3: U4.19(OCS_N3) ; port P3_FAULT
NetU2_P3_4: U4.18(PRTPWR3/BC_EN3) ; port P3_ENABLE

Not connected (* = marked no-connect by the designer): U4 8(USBDM_DN4/PRT_DIS_M4) 9(USBDP_DN4/PRT_DIS_P4) 20(PRTPWR4/BC_EN4) 21(OCS_N4)

### Notes on the sheet
- (near R8) Making a 12k resistor out of 1k and 10k is a quick way to keep your BoM uniques count lower! Yay for manufacturing limitations?
- Per datasheet table 5-1, CFG_SEL[1:0] should be 0b00, to enable the default (non-EEPROM) config.
  Also, per section 3.3.1, the strap pins (except SUSP_IND) have internal pull-downs. So if you want a strap "low" config, all you gotta do is leave the pin floating!
  Because of this, we'll put strap resistors to high on all of the config pins, just in case, and DNP them as needed.
- (near R15) This pull-up turns on battery charging mode on Port 1.
- The datasheet and reference designs don't show what to do with this port, so we leave it floating (is this a good idea?)
- Fault pins have built-in pull-up resistor, so nothing external is required.
- Copyright Ploopy Corporation 2020
- Licensed under the CERN OHL v. 1.2
- http://ohwr.org/cernohl
- Title:
- PCB:
- Version:
- Ploopy Corporation
- Mississauga ON L5C 0A3
- 137-1140 Burnhamthorpe Road W
- Date:
- Time:
- Sheet
- of
- Canada
- (in symbol TSX-3225 24.0000) 24MHz
- (in symbol USB2513B-AEZC-TR) Upstream USB; USB Data bias resistor; Downstream USB; Active/Suspend Indicator; Upstream Hi-speed strap; Management Interface; Battery Charge EN; Over-Current Sense; NC -- to GND

### Library data of the parts
C11 C12 = Cap 18pF 50V: 0603, C0G or better; Supplier 1: Digi-Key; Supplier Part Number 1: 1292-1494-1-ND
C13 = Cap 1uF 25V: 0805, X5R or better; Supplier 1: Digi-Key; Supplier Part Number 1: 1276-1066-2-ND; Supplier 2: Digi-Key; Supplier Part Number 2: 1276-1066-1-ND
C16 C21 = Cap 10uF 25V: 0805, X5R or better; Supplier 1: Mouser; Supplier Part Number 1: 81-GRM21BR61E106KA3L; Supplier 2: Digi-Key; Supplier Part Number 2: 490-5523-1-ND
C17-C20 C22-C25 = Cap 0.1uF 100V: 0805, X5R or better; Supplier 1: Digi-Key; Supplier Part Number 1: 1276-6840-2-ND
R6 R7 R15 R18 = Res 1k 1% 0805: Chip resistor, 1/8W 100PPM; Supplier 1: Digi-Key; Supplier Part Number 1: RMCF0805FT1K00TR-ND
R8 = Res 10k 1% 0805: Chip resistor; Supplier 1: Digi-Key; Supplier Part Number 1: RMCF0805FT10K0TR-ND
R9-R14 R16 R17 = Res 100k 1% 0805: Chip resistor; Supplier 1: Digi-Key; Supplier 2: Digi-Key; Supplier Part Number 1: RMCF0805FT100KTR-ND; Supplier Part Number 2: RMCF0805FT100KCT-ND
SW1 = EVQ-P7A01P: Tactile Switches 3.5x2.9mm Right Ang Light Touch Switch
U4 = USB2513B-AEZC-TR: USB Hub Controller USB 2.0 USB Interface 36-QFN (6x6); Supplier 1: Digi-Key; Supplier 2: Mouser; Supplier Part Number 1: USB2513B-AEZC-CT-ND; Supplier Part Number 2: 886-USB2513B-AEZCTR
Y1 = TSX-3225 24.0000: 24MHz ±10ppm Crystal 9pF 40 Ohms 4-SMD, No Lead; Supplier 1: Digi-Key; Supplier 2: Mouser; Supplier Part Number 2: 732-22524MF15X-AC6; Supplier Part Number 1: SER4180CT-ND

## Nets that join several sheets
3V3: Regulator (C8.2 C9.2 U3.5), HubHub (20 pins)
5V: P2 (U2_P2.5), PowerConnector (7 pins), DownstreamChargingPort (U1.5), Regulator (C7.2 U3.1 U3.3), P3 (U2_P3.5)
GND: P2 (6 pins), UpstreamPort (5 pins), PowerConnector (FB7.1 FB8.1 Z4.2), DownstreamChargingPort (6 pins), Regulator (5 pins), HubHub (23 pins), P3 (6 pins)
SHIELD: P2 (J4_P2.5), UpstreamPort (C4.2 C26.2 J2.SHELL R4.2), DownstreamChargingPort (J1.5), P3 (J4_P3.5)
NetR2_1: UpstreamPort (R2.1 R3.2), HubHub (U4.27)
NetR15_1: DownstreamChargingPort (U1.4), HubHub (R15.1 U4.12)
NetU1_3: DownstreamChargingPort (U1.3), HubHub (U4.13)
NetU2_P2_3: P2 (U2_P2.3), HubHub (U4.17)
NetU2_P2_4: P2 (U2_P2.4), HubHub (U4.16)
NetU2_P3_3: HubHub (U4.19), P3 (U2_P3.3)
NetU2_P3_4: HubHub (U4.18), P3 (U2_P3.4)
P1_D_N: DownstreamChargingPort (J1.2 Z1.6), HubHub (U4.1)
P1_D_P: DownstreamChargingPort (J1.3 Z1.1), HubHub (U4.2)
P2_D_N: P2 (J4_P2.2 Z3_P2.6), HubHub (U4.3)
P2_D_P: P2 (J4_P2.3 Z3_P2.1), HubHub (U4.4)
P3_D_N: HubHub (U4.6), P3 (J4_P3.2 Z3_P3.6)
P3_D_P: HubHub (U4.7), P3 (J4_P3.3 Z3_P3.1)
UPSTREAM_D_N: UpstreamPort (J2.A7 J2.B7 Z2.6), HubHub (U4.30)
UPSTREAM_D_P: UpstreamPort (J2.A6 J2.B6 Z2.1), HubHub (U4.31)

## Assembly variants
BoM: not fitted HHB.R.9 HHB.R.11 HHB.R.12 HHB.R.13 HHB.R.14 HHB.R.16 HHB.R.17